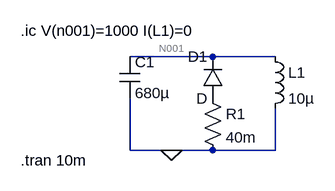
[diagram p0: schematic HW1q2.asc]
HW1q2.asc, the LTspice schematic file:
Version 4.1
SHEET 1 880 680
WIRE 192 112 64 112
WIRE 288 112 192 112
WIRE 64 256 64 176
WIRE 128 256 64 256
WIRE 192 256 128 256
WIRE 288 256 288 192
WIRE 288 256 192 256
FLAG 128 256 0
SYMBOL cap 48 112 R0
SYMATTR InstName C1
SYMATTR Value 680µ
SYMBOL res 176 160 R0
SYMATTR InstName R1
SYMATTR Value 40m
SYMBOL diode 208 176 R180
WINDOW 0 24 64 Left 2
WINDOW 3 24 0 Left 2
SYMATTR InstName D1
SYMBOL ind 272 96 R0
SYMATTR InstName L1
SYMATTR Value 10µ
TEXT -104 72 Left 2 !.ic V(n001)=1000 I(L1)=0
TEXT -104 272 Left 2 !.tran 10m

The netlist it stands for:
* HW1q2.asc
C1 N001 0 680µ
R1 P001 0 40m
D1 P001 N001 D
L1 N001 0 10µ
.model D D
.lib standard.dio
.ic V(n001)=1000 I(L1)=0
.tran 10m
.backanno
.end